# EAGLE design blink1_v2d (EAGLE 6.4)
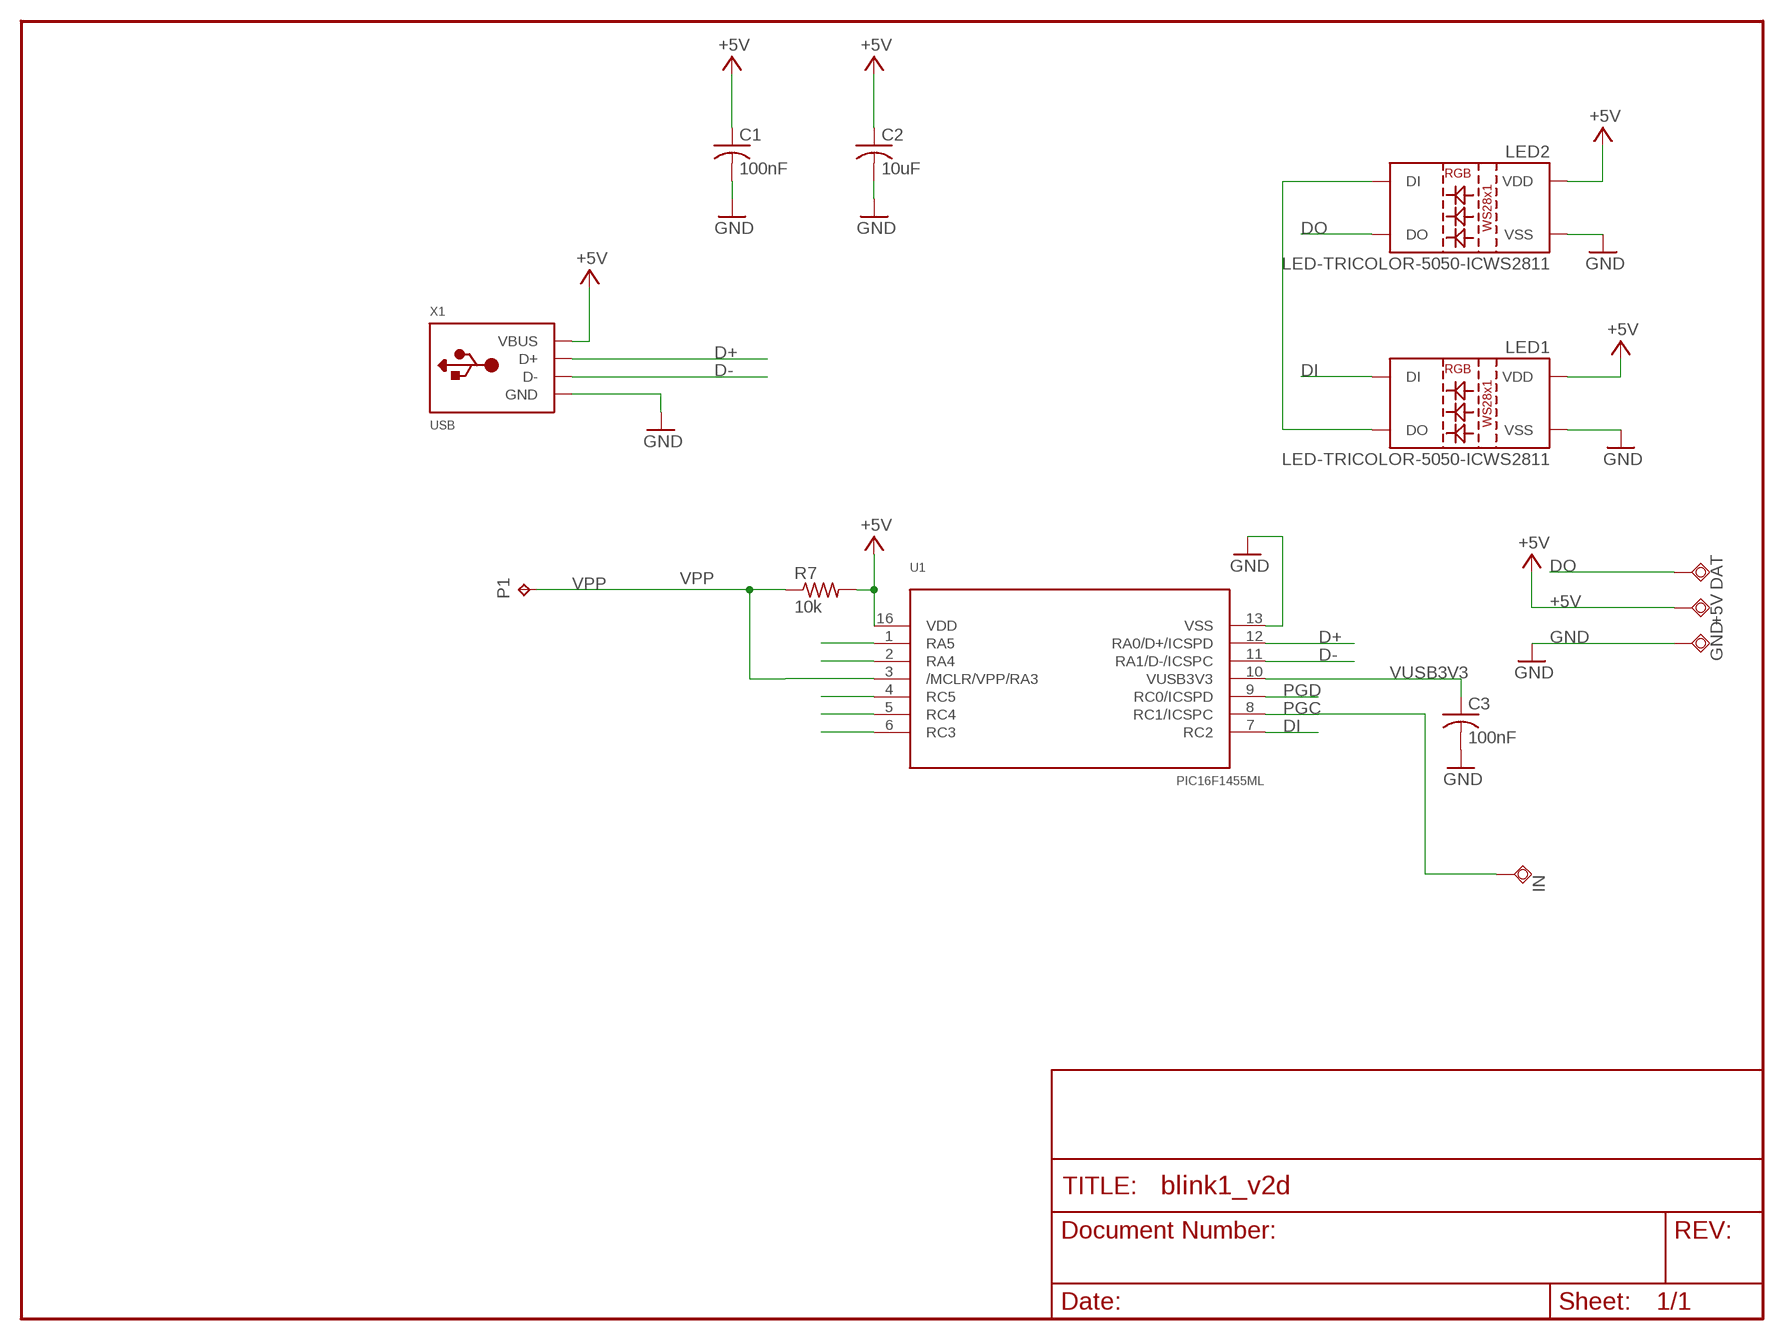
[diagram p0: schematic, sheet 1]

## Parts
+5V  TPSQTP12SQ  [TP12SQ]
C1  100nF  C-USC0603  [C0603]
C2  10uF  C-USC0603  [C0603]
C3  100nF  C-USC0603  [C0603]
DAT  TPSQTP12SQ  [TP12SQ]
GND  TPSQTP12SQ  [TP12SQ]
IN  TPSQTP12SQ  [TP12SQ]
LED1  LED-TRICOLOR-5050-ICWS2811  [LED-TRICOLOR-5050-IC]
LED2  LED-TRICOLOR-5050-ICWS2811  [LED-TRICOLOR-5050-IC]
P1  TPTP11SQ  [TP11SQ]
R7  10k  R-US_R0603  [R0603]
U1  PIC16F1455ML  [QFN16_4X4]
X1  USB  [MOLEX-48037-1000]

## Nets
+5V: +5V.TP C1.1 C2.1 LED1.3(VDD) LED1.5(VDD) LED2.3(VDD) LED2.5(VDD) R7.2 U1.16(VDD) X1.1(VBUS)
D+: U1.12(RA0/D+/ICSPD) X1.3(D+)
D-: U1.11(RA1/D-/ICSPC) X1.2(D-)
DI: LED1.2(DI) U1.7(RC2)
DO: DAT.TP LED2.1(DO)
GND: C1.2 C2.2 C3.2 GND.TP LED1.6(VSS) LED2.6(VSS) U1.13(VSS) X1.4(GND)
N$1: LED1.1(DO) LED2.2(DI)
N$2: U1.1(RA5)
N$3: U1.6(RC3)
N$4: U1.5(RC4)
N$5: U1.2(RA4)
N$6: U1.4(RC5)
PGC: IN.TP U1.8(RC1/ICSPC)
PGD: U1.9(RC0/ICSPD)
VPP: P1.TP R7.1 U1.3(/MCLR/VPP/RA3)
VUSB3V3: C3.1 U1.10(VUSB3V3)

## Library data of the parts
+5V DAT GND IN = testpad:TPSQ: Test pad
C1-C3 = rcl:C-US: CAPACITOR, American symbol
LED1 LED2 = SparkFun-LED:LED-TRICOLOR-5050-IC: 5x5mm SMD LED with built-in controller IC.
P1 = testpad:TP: Test pad
R7 = rcl:R-US_: RESISTOR, American symbol
U1 = todstuffnew:PIC16F1455
X1 = todstuff:USB

## Board
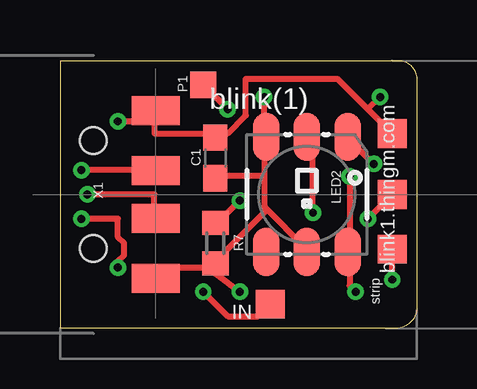
[diagram p1: board, top side]
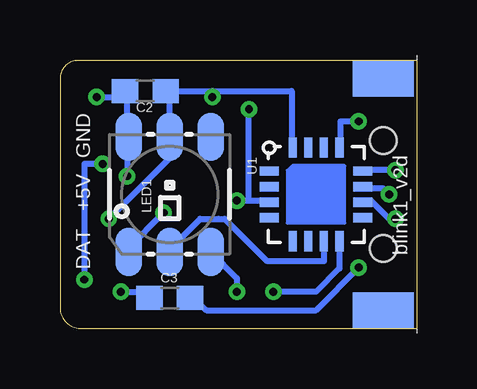
[diagram p2: board, bottom side, seen from below]

Size 14.86 x 11.18 mm. Coordinates in mm from the lower left corner, seen from the top.
Outline: 0,11.18 2.67,11.18 3.17,11.18 14.1,11.18 arc-90 14.86,10.42 14.86,0.77 arc-90 13.84,0.01 3.43,0.01 2.67,0.01 0,0.01 0,11.18
Copper layers (1*16): Top 0.0356mm / dielectric 1.5011mm / Bottom 0.0356mm
Design rules "LaenPCBOrder *": minimum track width 10mil, minimum drill 13mil, track to track 6mil, track to pad 8mil, pad to pad 8mil, via to via 8mil, smd to smd 6mil, copper to edge 15mil, drill to drill 8mil, minimum pad ring 7mil, minimum via ring 7mil, stop-mask expansion 4mil, vias tented up to drill 25mil, thermal gap 10mil

### Footprints (pad centres in the part's own frame; a part is rotated, then mirrored left to right if it is on the bottom)
TP12SQ = smd 1.2 x 1.2: TP 0,0
C0603 = smd 1.1 x 1: 1 -0.85,0; 2 0.85,0
LED-TRICOLOR-5050-IC = smd 2 x 1.1: 1 -2.4,1.7; 2 -2.4,0; 3 -2.4,-1.7; 4 2.4,-1.7; 5 2.4,0; 6 2.4,1.7
TP11SQ = smd 1.1 x 1.1: TP 0,0
R0603 = smd 1 x 1.1: 1 -0.85,0; 2 0.85,0
QFN16_4X4 = smd 0.8 x 0.35: 1 -1.95,0.975; 2 -1.95,0.325; 3 -1.95,-0.325; 4 -1.95,-0.975; 9 1.95,-0.975; 10 1.95,-0.325; 11 1.95,0.325; 12 1.95,0.975 | smd 0.35 x 0.8: 5 -0.975,-1.95; 6 -0.325,-1.95; 7 0.325,-1.95; 8 0.975,-1.95; 13 0.975,1.95; 14 0.325,1.95; 15 -0.325,1.95; 16 -0.975,1.95
MOLEX-48037-1000 = smd 2 x 1.2: 1 2.6,-3.5; 2 2.6,-1; 3 2.6,1; 4 2.6,3.5 | smd 2.54 x 1.524 bottom: P$1 0,4.85; P$2 0,-4.85 | hole 1.1: 0,2.25; 0,-2.25

### Placement (x,y rotation side)
+5V  13.84,5.6 0 top
C1  6.48,7.12 90 top
C2  11.3,9.91 180 bottom
C3  10.29,1.28 180 bottom
DAT  13.84,3.31 0 top
GND  13.84,8.14 0 top
IN  8.76,1.02 0 top
LED1  10.29,5.6 90 bottom
LED2  10.29,5.6 270 top
P1  5.97,10.17 0 top
R7  6.48,3.56 270 top
U1  4.19,5.6 0 bottom
X1  1.39,5.6 0 top

### Tracks (layer width: path | path; a pad name or v marks a point on that pad's centre or on a via)
+5V  (via drill 0.33)
  Top 0.254: v12.83,4.58 +5V.TP | 6.48,2.55 4.19,2.55 4.19,2.29 X1.1 | 6.48,2.55 R7.2 | v7.49,1.53 6.48,2.29 6.48,2.55 | 6.48,2.55 R7.2 | 8.51,6.36 6.48,6.36 C1.1 | 8.51,6.36 8.51,7.88 LED2.3 8.51,8.14 v8.51,9.66 | 8.51,5.09 10.29,3.31 LED2.5 | 8.51,6.36 8.51,5.09 | 8.51,5.09 8.51,4.83 6.48,2.8 R7.2
  Bottom 0.254: 10.29,9.91 8.51,9.91 | 8.51,9.91 5.21,9.91 5.21,7.63 U1.16 | 10.29,9.91 C2.1 10.29,9.91 | v12.83,4.58 10.29,7.12 10.29,7.88 LED1.5 10.29,8.14 10.29,9.91 | v8.51,9.66 8.51,9.91 | LED1.3 7.49,2.1 v7.49,1.53
D+  (via drill 0.33)
  Top 0.254: v0.89,6.61 3.94,6.61 X1.3
  Bottom 0.254: v0.89,6.61 2.16,6.61 U1.12
D-  (via drill 0.33)
  Top 0.254: v1.14,5.6 3.94,5.6 3.94,4.83 X1.2
  Bottom 0.254: v1.14,5.6 1.4,5.85 2.16,5.85 U1.11
DI
  Bottom 0.254: LED1.2 10.29,3.31 9.02,4.58 8.25,4.58 8,4.58 6.22,2.8 3.87,2.8 U1.7
DO  (via drill 0.33)
  Top 0.254: v13.84,2.04 DAT.TP | v13.08,6.87 12.06,7.88 LED2.1
  Bottom 0.254: v13.84,2.04 13.84,6.87 v13.08,6.87
GND  (via drill 0.33)
  Top 0.254: v12.32,1.53 12.06,1.79 12.06,3.06 LED2.6 12.06,3.31 v12.06,6.36 | 3.94,8.64 v2.41,8.64 | 3.94,8.64 3.94,8.9 X1.4 3.94,8.64 | 6.48,8.14 3.94,8.14 3.94,8.64 | 6.48,8.14 C1.2 6.48,8.14 | 12.83,9.15 11.56,10.42 7.75,10.42 7.75,8.9 6.99,8.14 6.48,8.14 | 12.83,9.15 GND.TP | 12.83,9.15 v13.33,9.66
  Bottom 0.254: v12.32,1.53 11.56,1.53 11.3,1.28 C3.2 | v2.41,8.64 3.17,8.64 3.17,7.63 U1.13 | v13.33,9.66 12.57,9.66 12.32,9.91 C2.2 12.06,9.91 12.06,8.14 LED1.6 12.06,7.88 v12.06,6.36
N$1  (via drill 0.33)
  Top 0.254: v10.54,4.83 10.54,7.63 10.29,7.88 LED2.2
  Bottom 0.254: v10.54,4.83 12.06,3.31 LED1.1
PGC  (via drill 0.33)
  Top 0.254: v5.97,1.53 6.99,0.52 7.49,0.52 8.25,0.52 IN.TP
  Bottom 0.254: U1.8 3.22,2.51 4.19,1.53 v5.97,1.53
VPP  (via drill 0.33)
  Top 0.254: v7.49,5.34 6.48,4.33 R7.1 | v6.99,9.15 P1.TP
  Bottom 0.254: v7.49,5.34 6.99,5.34 | 6.99,5.34 6.22,5.34 U1.3 | 6.99,5.34 v6.99,9.15
VUSB3V3  (via drill 0.33)
  Top 0.254: v0.89,4.58 2.41,4.58 2.41,3.82 2.67,3.56 2.67,3.06 2.41,2.8 v2.41,2.55
  Bottom 0.254: v0.89,4.58 1.14,4.58 1.91,5.34 2.16,5.34 U1.10 | v2.41,2.55 4.19,0.77 8.76,0.77 9.27,1.28 C3.1

### Text on the board
tPlace: blink(1) | blink1.thingm.com | strip
bPlace: blink1_v2d